# Altium schematic sheet 05_POWER_MCU_2.SchDoc
size 420 x 297 mm; SheetNumber: 9; SheetTotal: 29
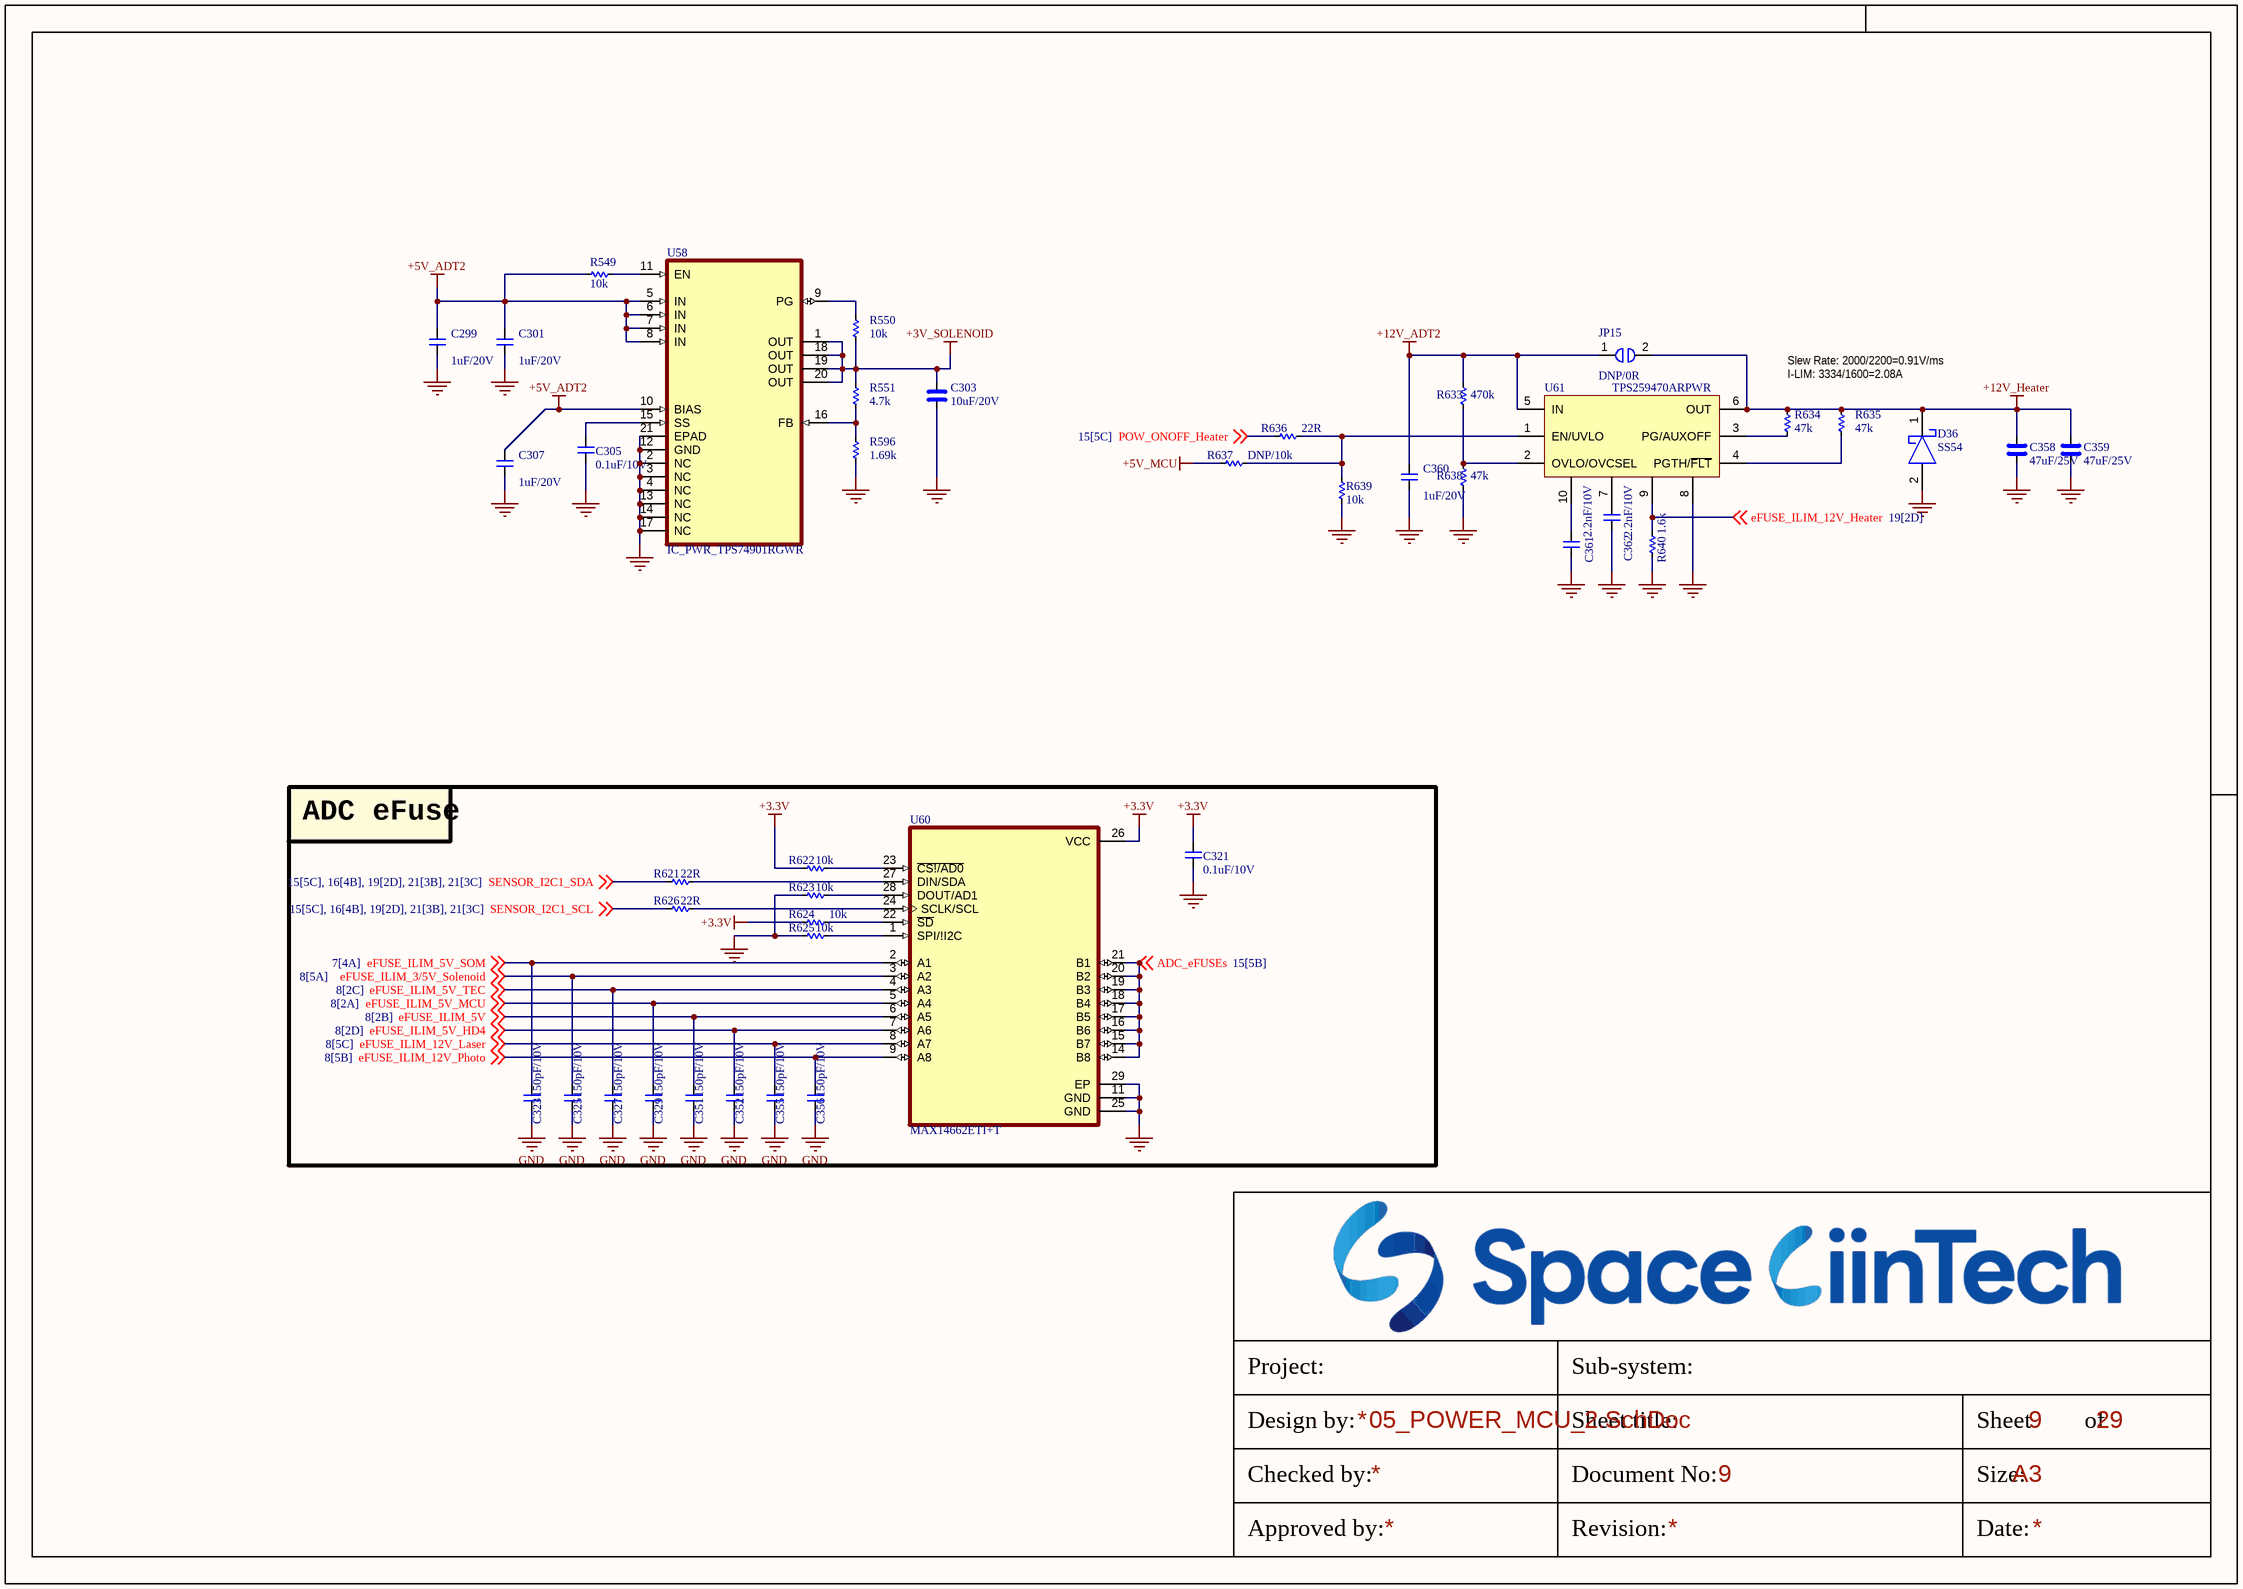
[diagram p0: 05_POWER_MCU_2.SchDoc]

## Parts
C299  1uF/20V  [CAP_C_1005X60]
C301  1uF/20V  [CAP_C_1005X60]
C303  10uF/20V  [CAP_C_2012X110]
C305  0.1uF/10V  [CAP_C_1005X60]
C307  1uF/20V  [CAP_C_1005X60]
C321  0.1uF/10V  [CAP_C_1005X60]
C323  150pF/10V  [CAP_C_1005X60]
C325  150pF/10V  [CAP_C_1005X60]
C327  150pF/10V  [CAP_C_1005X60]
C329  150pF/10V  [CAP_C_1005X60]
C351  150pF/10V  [CAP_C_1005X60]
C352  150pF/10V  [CAP_C_1005X60]
C355  150pF/10V  [CAP_C_1005X60]
C356  150pF/10V  [CAP_C_1005X60]
C358  47uF/25V  [CAP_C_3225X80]
C359  47uF/25V  [CAP_C_3225X80]
C360  1uF/20V  [CAP_C_1005X60]
C361  2.2nF/10V  [CAP_C_1005X60]
C362  2.2nF/10V  [CAP_C_1005X60]
D36  SS54  [DO-214AC_SMA]
JP15  DNP/0R  [RES_C_1608X60]
R549  10k  [RES_C_1005X40]
R550  10k  [RES_C_1005X40]
R551  4.7k  [RES_C_1005X40]
R596  1.69k  [RES_C_1005X40]
R621  22R  [RES_C_1005X40]
R622  10k  [RES_C_1005X40]
R623  10k  [RES_C_1005X40]
R624  10k  [RES_C_1005X40]
R625  10k  [RES_C_1005X40]
R626  22R  [RES_C_1005X40]
R633  470k  [RES_C_1005X40]
R634  47k  [RES_C_1005X40]
R635  47k  [RES_C_1005X40]
R636  22R  [RES_C_1005X40]
R637  DNP/10k  [RES_C_1005X40]
R638  47k  [RES_C_1005X40]
R639  10k  [RES_C_1005X40]
R640  1.6k  [RES_C_1005X40]
U58  IC_PWR_TPS74901RGWR  [QFN65P500X500X100-21N]
U60  MAX14662ETI+T  [QFN40P400X400X80-29N]
U61  TPS259470ARPWR  [VQFN-HR-10]

## Blocks framed on the sheet
ADC eFuse: C321 C323 C325 C327 C329 C351 C352 C355 C356 R621-R626 U60

## Nets
+3.3V: C321.2 R622.1 R624.1 U60.26(VCC)
+3V_SOLENOID: C303.1 R550.1 R551.2 U58.1(OUT) U58.18(OUT) U58.19(OUT) U58.20(OUT)
+5V_ADT2: C299.2 C301.2 C307.2 R549.2 U58.5(IN) U58.6(IN) U58.7(IN) U58.8(IN) U58.10(BIAS)
+5V_MCU: R637.2
+12V_ADT2: C360.2 JP15.1 R633.2 U61.5(IN)
+12V_Heater: C358.2 C359.2 D36.1 JP15.2 R634.2 R635.2 U61.6(OUT)
GND: C299.1 C301.1 C303.2 C305.1 C307.1 C321.1 C323.1 C325.1 C327.1 C329.1 C351.1 C352.1 C355.1 C356.1 C358.1 C359.1 C360.1 C361.1 C362.1 D36.2 R596.1 R623.1 R625.1 R638.1 R639.2 R640.1 U58.2(NC) U58.3(NC) U58.4(NC) U58.12(GND) U58.13(NC) U58.14(NC) U58.17(NC) U58.21(EPAD) U60.11(GND) U60.25(GND) U60.29(EP) U61.8
ADC_eFUSEs: U60.14(B8) U60.15(B7) U60.16(B6) U60.17(B5) U60.18(B4) U60.19(B3) U60.20(B2) U60.21(B1) ; off-sheet ADC_eFUSEs
eFUSE_ILIM_3/5V_Solenoid: C325.2 U60.3(A2) ; off-sheet eFUSE_ILIM_3/5V_Solenoid
eFUSE_ILIM_5V: C351.2 U60.6(A5) ; off-sheet eFUSE_ILIM_5V
eFUSE_ILIM_5V_HD4: C352.2 U60.7(A6) ; off-sheet eFUSE_ILIM_5V_HD4
eFUSE_ILIM_5V_MCU: C329.2 U60.5(A4) ; off-sheet eFUSE_ILIM_5V_MCU
eFUSE_ILIM_5V_SOM: C323.2 U60.2(A1) ; off-sheet eFUSE_ILIM_5V_SOM
eFUSE_ILIM_5V_TEC: C327.2 U60.4(A3) ; off-sheet eFUSE_ILIM_5V_TEC
eFUSE_ILIM_12V_Heater: R640.2 U61.9 ; off-sheet eFUSE_ILIM_12V_Heater
eFUSE_ILIM_12V_Laser: C355.2 U60.8(A7) ; off-sheet eFUSE_ILIM_12V_Laser
eFUSE_ILIM_12V_Photo: C356.2 U60.9(A8) ; off-sheet eFUSE_ILIM_12V_Photo
POW_ONOFF_Heater: R636.2 ; off-sheet POW_ONOFF_Heater
SENSOR_I2C1_SCL: R626.1 ; off-sheet SENSOR_I2C1_SCL
SENSOR_I2C1_SDA: R621.1 ; off-sheet SENSOR_I2C1_SDA
NetC305_2: C305.2 U58.15(SS)
NetC361_2: C361.2 U61.10
NetC362_2: C362.2 U61.7
NetR549_1: R549.1 U58.11(EN)
NetR550_2: R550.2 U58.9(PG)
NetR551_1: R551.1 R596.2 U58.16(FB)
NetR621_2: R621.2 U60.27(DIN/SDA)
NetR622_2: R622.2 U60.23(~{CS!/AD0})
NetR623_2: R623.2 U60.28(DOUT/AD1)
NetR624_2: R624.2 U60.22(~{SD})
NetR625_2: R625.2 U60.1(SPI/!I2C)
NetR626_2: R626.2 U60.24(SCLK/SCL)
NetR633_1: R633.1 R638.2 U61.2(OVLO/OVCSEL)
NetR634_1: R634.1 U61.3(PG/AUXOFF)
NetR635_1: R635.1 U61.4(PGTH/~{FLT})
NetR636_1: R636.1 R637.1 R639.1 U61.1(EN/UVLO)

## Notes on the sheet
- Slew Rate: 2000/2200=0.91V/ms
- I-LIM: 3334/1600=2.08A
- Project:
- Sub-system:
- Design by:
- Sheet title:
- Sheet
- of
- Checked by:
- Approved by:
- Revision:
- Document No:
- Size:
- Date:
- A3

## Library data of the parts
C299 C301 C305 C307 C321 C323 C325 C327 C329 C351 C352 C355 C356 C360-C362 = _CAP_C_2: CAP CHIP
C303 C358 C359 = _CAP_C_High_2: CAP CHIP High Value
D36 = SS54: DIODE SCHOTTKY 60V 3A DO214AA
JP15 = JUMPER_1_1
R549-R551 R596 R621-R626 R633-R640 = _RES_B_2: RES
U58 = IC_PWR_TPS74901RGWR: 3-A, low-VIN (0.8-V), adjustable ultra-low-dropout voltage regulator with power good & enable 20-VQFN -40 to 125; MF: Texas Instruments; Price: None; Check_prices: https://www.snapeda.com/parts/TPS74901RGWR/Texas%20Instruments/view-part/1101342/?ref=eda; SnapEDA_Link: https://www.snapeda.com/parts/TPS74901RGWR/Texas%20Instruments/view-part/1101342/?ref=snap; Package: VQFN-20 Texas Instruments; Purchase-URL: https://pricing.snapeda.com/search/part/TPS74901RGWR/?ref=eda; Availability: Good; MP: TPS74901RGWR; Value: *
U60 = IC_SW_MAX14662ETI+T: 8 Circuit IC Switch 1:1 1Ohm 28-TQFN _4x4_; MF: Maxim Integrated; Package: TQFN-28 Maxim; Value: *; Price: None; MP: MAX14662ETI+T; SnapEDA_Link: https://www.snapeda.com/parts/MAX14662ETI%2BT/Maxim%20Integrated/view-part/546683/?ref=snap; Availability: Unavailable